# Altium schematic sheet comm_connector.SchDoc
size A
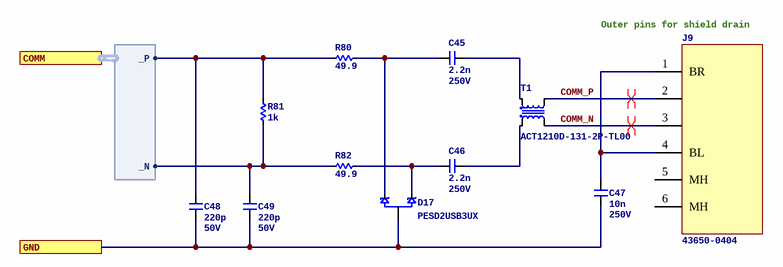
[diagram p0: comm_connector.SchDoc]

## Parts
C45  Capacitance: 2.2n  Voltage Rating: 250V  [C0805]  (hidden comment: CGA4J3C0G2E222JT0Y0N)
C46  Capacitance: 2.2n  Voltage Rating: 250V  [C0805]  (hidden comment: CGA4J3C0G2E222JT0Y0N)
C47  Capacitance: 10n  Voltage Rating: 250V  [C0805]  (hidden comment: CC0805KKX7RYBB103)
C48  Capacitance: 220p  Voltage Rating: 50V  [C0402]  (hidden comment: GRM1555C1H221JA01D)
C49  Capacitance: 220p  Voltage Rating: 50V  [C0402]  (hidden comment: GRM1555C1H221JA01D)
D17  PESD2USB3UX  [3SOT23]
J9  43650-0404  [MOLEX_MICROFIT_0436500404]
R80  value 49.9  [R0402]  (hidden comment: 0402WGF499JTCE)
R81  value 1k  [R0603]  (hidden comment: HP03W5F1001T5E)
R82  value 49.9  [R0402]  (hidden comment: 0402WGF499JTCE)
T1  ACT1210D-131-2P-TL00  [CHOKE_ACT1210D-131-2P-TL00]

## Ports
COMM (harness DIFF), GND

## Harnesses
DIFF: _P, _N

## Nets
COMM_N: J9.3 T1.3
COMM_P: J9.2 T1.4
GND: C47.2 C48.2 C49.2 D17.3 ; port GND
NetC45_1: C45.1 D17.2 R80.2
NetC45_2: C45.2 T1.1
NetC46_1: C46.1 D17.1 R82.2
NetC46_2: C46.2 T1.2
NetC47_1: C47.1 J9.1(BR) J9.4(BL)
NetC48_1: C48.1 R80.1 R81.2 ; port COMM._P
NetC49_1: C49.1 R81.1 R82.1 ; port COMM._N

Not connected (* = marked no-connect by the designer): J9 5(MH) 6(MH)

## Layout directives
differential pair; differential pair class DE_100: COMM_N, COMM_P

## Notes on the sheet
- (near J9) Outer pins for shield drain

## Library data of the parts
C45 C46 = CGA4J3C0G2E222JT0Y0N: Manufacturer: TDK; Dielectric: C0G; Manufacturer Part Number: CGA4J3C0G2E222JT0Y0N; ComponentLink1URL: https://wmsc.lcsc.com/wmsc/upload/file/pdf/v2/lcsc/2304140030_TDK-CGA4J3C0G2E222JT0Y0N_C694233.pdf; ComponentLink1Description: Datasheet; Package: 0805; Supplier 2: LCSC; Supplier Part Number 2: C694233
C47 = CC0805KKX7RYBB103: Manufacturer: YAGEO; Dielectric: X7R; Manufacturer Part Number: CC0805KKX7RYBB103; ComponentLink1URL: https://wmsc.lcsc.com/wmsc/upload/file/pdf/v2/lcsc/2304140030_YAGEO-CC0805KKX7RYBB103_C106841.pdf; ComponentLink1Description: Datasheet; Package: 0805; Supplier 2: LCSC; Supplier Part Number 2: C106841
C48 C49 = GRM1555C1H221JA01D: Manufacturer: Murata Electronics; Dielectric: C0G; Manufacturer Part Number: GRM1555C1H221JA01D; ComponentLink1URL: https://wmsc.lcsc.com/wmsc/upload/file/pdf/v2/lcsc/1811081614_Murata-Electronics-GRM1555C1H221JA01D_C71693.pdf; ComponentLink1Description: Datasheet; Package: 0402; Supplier 2: LCSC; Supplier Part Number 2: C71693
D17 = TVS_PESD2USB3UX-T: DIODE ESD USB SOT-23; Manufacturer: Nexperia USA Inc.; Supplier 1: Digikey; Supplier Part Number 1: 1727-PESD2USB3UX-CT-ND; Manufacturer Part Number: PESD2USB3UX; Supplier 2: LCSC; Supplier Part Number 2: C3708426; ComponentLink1Description: Datasheet; ComponentLink1URL: https://assets.nexperia.com/documents/data-sheet/PESD2USB3UX-T.pdf
J9 = CONN_MOLEX_MICROFIT_4POS_RA_43650-0404: Conn Wire to Board HDR 4 POS 3mm Solder RA Thru-Hole 4 Terminal 1 Port Micro-Fit 3.0; Manufacturer: Molex; Supplier: Digikey; Supplier Part Number: WM1877-ND; Manufacturer Part Number: 43650-0404; Parameter 1: *; Parameter 2: *; ComponentLink1Description: Drawing; ComponentLink1URL: https://www.molex.com/content/dam/molex/molex-dot-com/products/automated/en-us/salesdrawingpdf/436/43650/436500404_sd.pdf?inline; ComponentLink2Description: Product page; ComponentLink2URL: https://www.molex.com/en-us/products/part-detail/436500404
R80 R82 = 0402WGF499JTCE: Manufacturer: UNI-ROYAL(Uniroyal Elec); Tolerance: 1%; Temperature Coefficient: Â±100ppm/â„ƒ; Power Rating (mW): 62.5; Manufacturer Part Number: 0402WGF499JTCE; ComponentLink1Description: Datasheet; ComponentLink1URL: https://wmsc.lcsc.com/wmsc/upload/file/pdf/v2/lcsc/2205311900_UNI-ROYAL-Uniroyal-Elec-0402WGF499JTCE_C25120.pdf; Package: 0402; Supplier 2: LCSC; Supplier Part Number 2: C25120
R81 = HP03W5F1001T5E: Manufacturer: UNI-ROYAL(Uniroyal Elec); Tolerance: 1%; Temperature Coefficient: Â±100ppm/â„ƒ; Power Rating (mW): 200; Manufacturer Part Number: HP03W5F1001T5E; ComponentLink1Description: Datasheet; ComponentLink1URL: https://wmsc.lcsc.com/wmsc/upload/file/pdf/v2/lcsc/2304140030_UNI-ROYAL-Uniroyal-Elec-HP03W5F1001T5E_C2759450.pdf; Package: 0603; Supplier 2: LCSC; Supplier Part Number 2: C2759450
T1 = CHOKE_ACT1210D-131-2P-TL00: 130 µH @ 100 kHz 2 Line Common Mode Choke Surface Mount 6.7 kOhms @ 10 MHz 115mA DCR 3.5Ohm; Manufacturer: TDK Corporation; Supplier 1: Digikey; ComponentLink1URL: https://product.tdk.com/system/files/dam/doc/product/emc/emc/cmf_cmc/catalog/cmf_automotive_signal_act1210d_en.pdf; ComponentLink1Description: Datasheet; Supplier Part Number 1: 445-ACT1210D-131-2P-TL00CT-ND; Manufacturer Part Number: ACT1210D-131-2P-TL00; Supplier 2: LCSC; Supplier Part Number 2: C5547342